# Altium schematic sheet Array.SchDoc
size C; Author: E. Sims; Organization: Let's Build Rockets Inc.; SheetNumber: 1; SheetTotal: 2
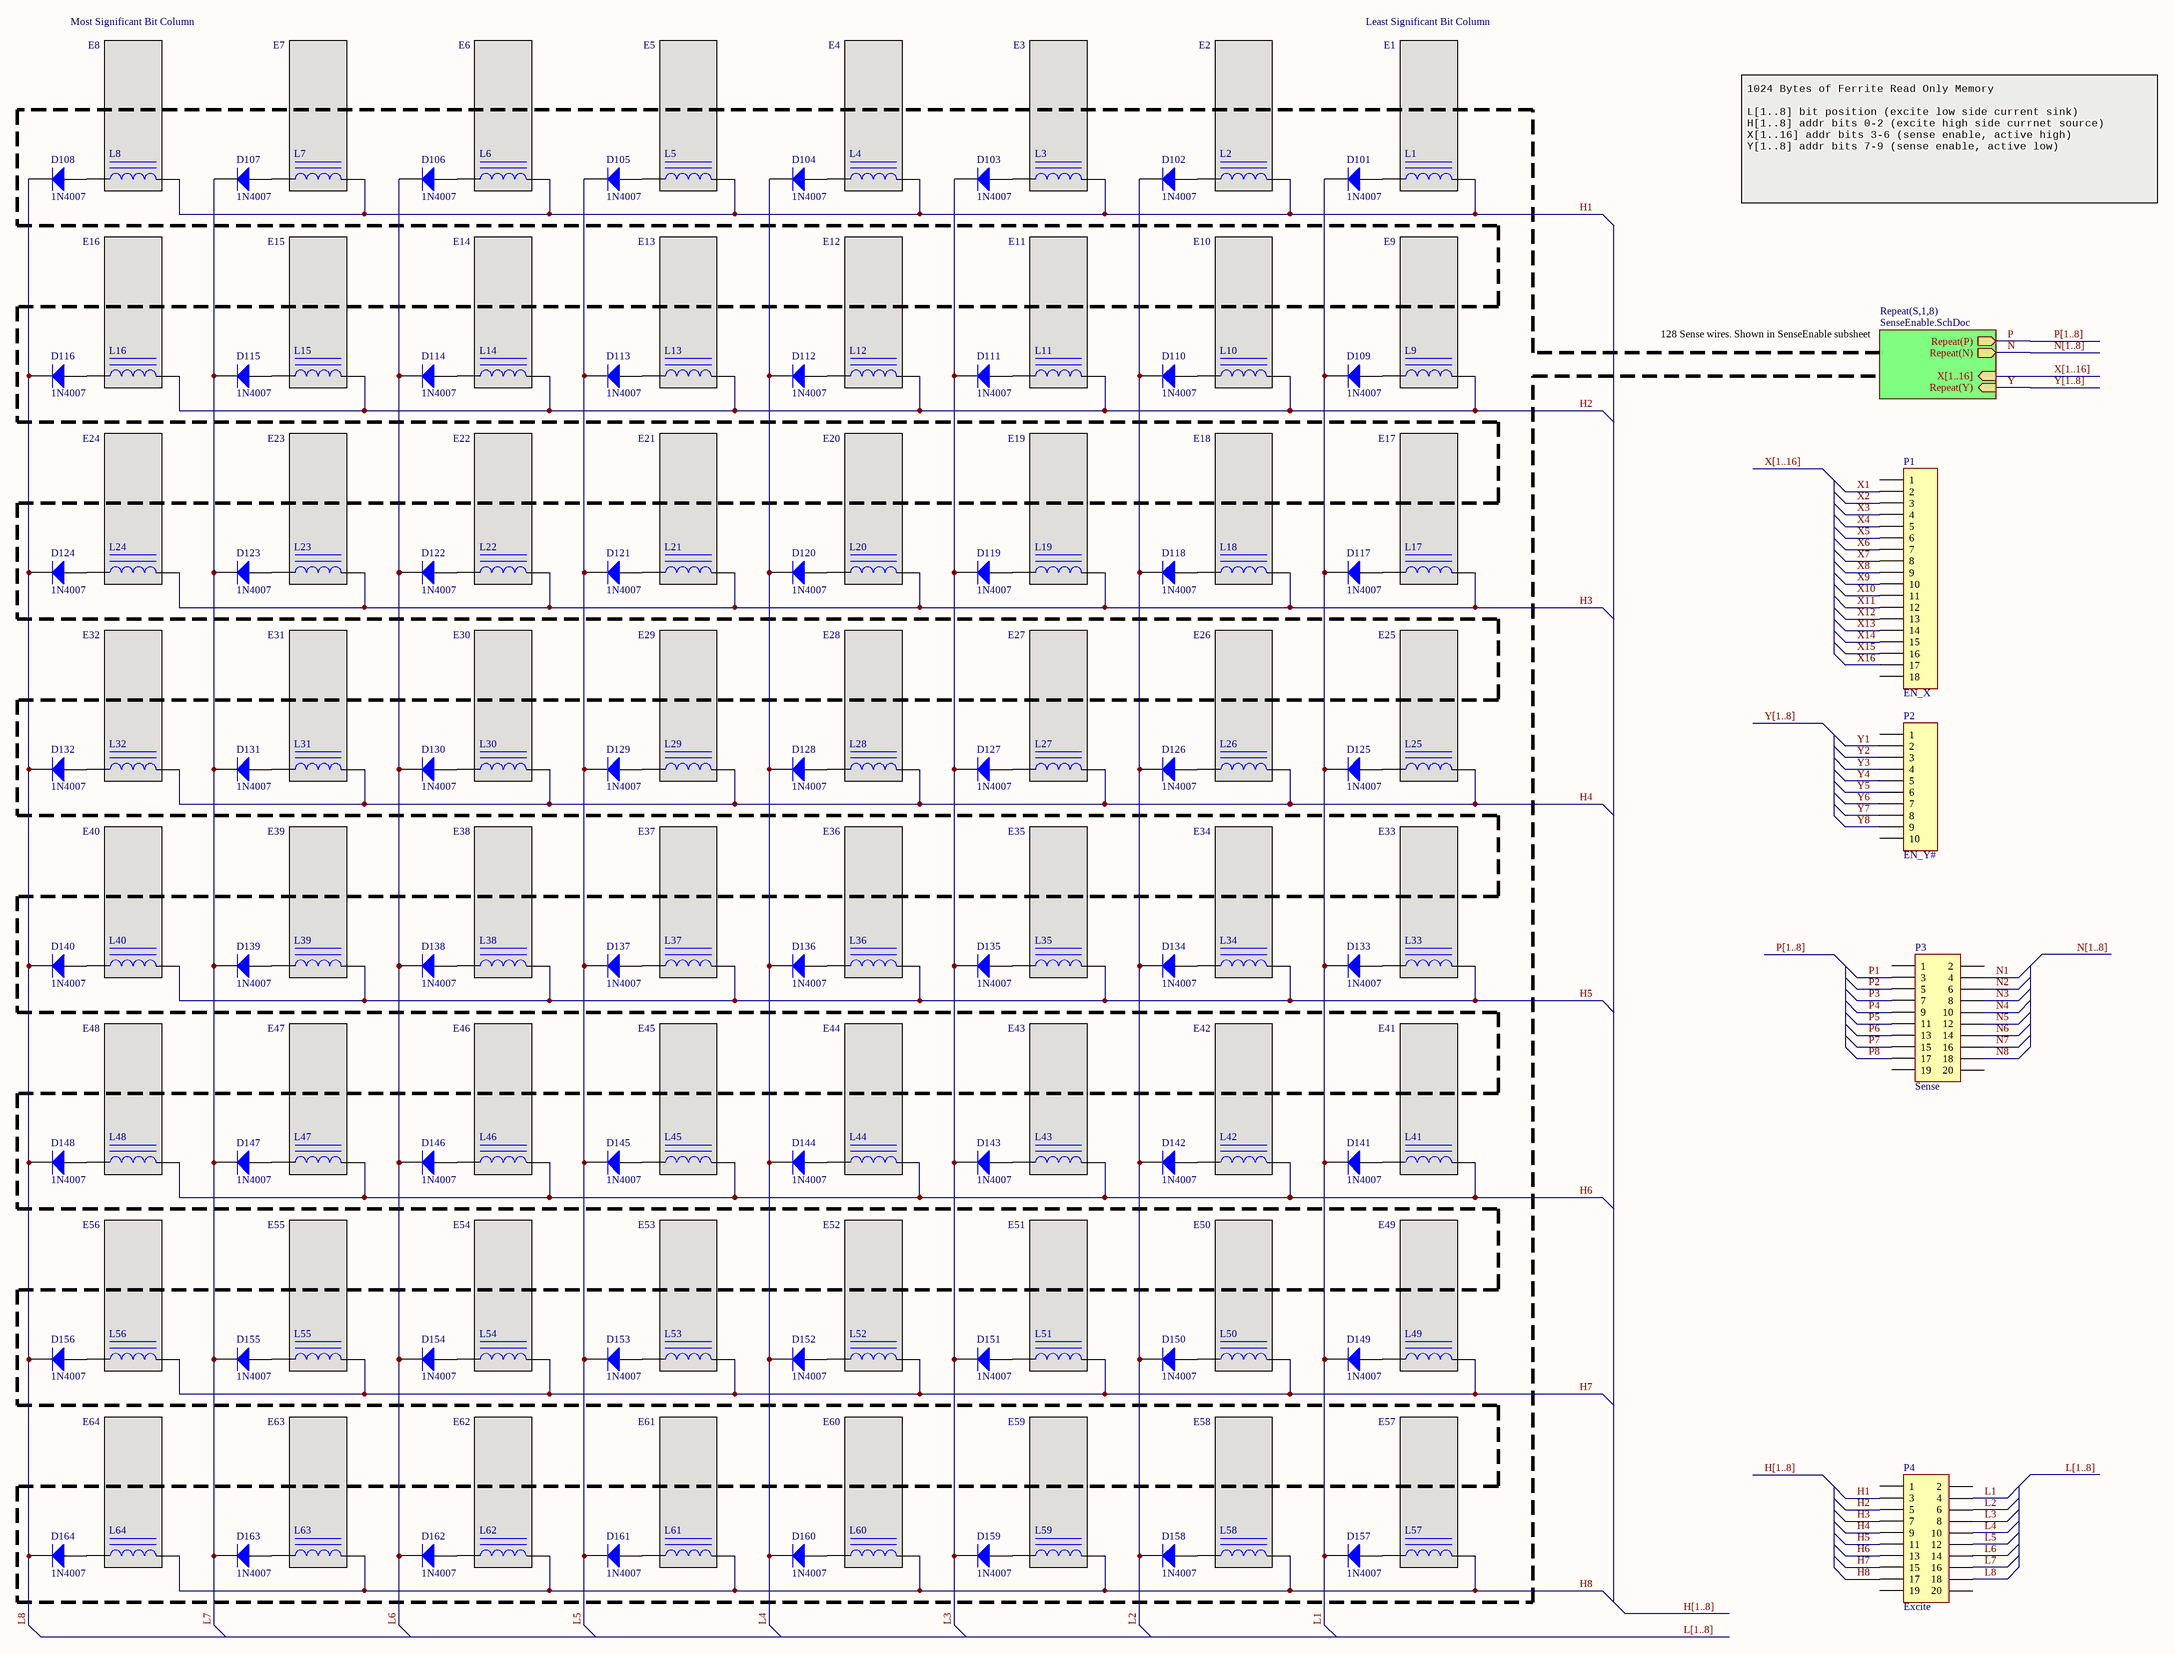
[diagram p0: Array.SchDoc]

## Parts
D101  1N4007  [DO-41]
D102  1N4007  [DO-41]
D103  1N4007  [DO-41]
D104  1N4007  [DO-41]
D105  1N4007  [DO-41]
D106  1N4007  [DO-41]
D107  1N4007  [DO-41]
D108  1N4007  [DO-41]
D109  1N4007  [DO-41]
D110  1N4007  [DO-41]
D111  1N4007  [DO-41]
D112  1N4007  [DO-41]
D113  1N4007  [DO-41]
D114  1N4007  [DO-41]
D115  1N4007  [DO-41]
D116  1N4007  [DO-41]
D117  1N4007  [DO-41]
D118  1N4007  [DO-41]
D119  1N4007  [DO-41]
D120  1N4007  [DO-41]
D121  1N4007  [DO-41]
D122  1N4007  [DO-41]
D123  1N4007  [DO-41]
D124  1N4007  [DO-41]
D125  1N4007  [DO-41]
D126  1N4007  [DO-41]
D127  1N4007  [DO-41]
D128  1N4007  [DO-41]
D129  1N4007  [DO-41]
D130  1N4007  [DO-41]
D131  1N4007  [DO-41]
D132  1N4007  [DO-41]
D133  1N4007  [DO-41]
D134  1N4007  [DO-41]
D135  1N4007  [DO-41]
D136  1N4007  [DO-41]
D137  1N4007  [DO-41]
D138  1N4007  [DO-41]
D139  1N4007  [DO-41]
D140  1N4007  [DO-41]
D141  1N4007  [DO-41]
D142  1N4007  [DO-41]
D143  1N4007  [DO-41]
D144  1N4007  [DO-41]
D145  1N4007  [DO-41]
D146  1N4007  [DO-41]
D147  1N4007  [DO-41]
D148  1N4007  [DO-41]
D149  1N4007  [DO-41]
D150  1N4007  [DO-41]
D151  1N4007  [DO-41]
D152  1N4007  [DO-41]
D153  1N4007  [DO-41]
D154  1N4007  [DO-41]
D155  1N4007  [DO-41]
D156  1N4007  [DO-41]
D157  1N4007  [DO-41]
D158  1N4007  [DO-41]
D159  1N4007  [DO-41]
D160  1N4007  [DO-41]
D161  1N4007  [DO-41]
D162  1N4007  [DO-41]
D163  1N4007  [DO-41]
D164  1N4007  [DO-41]
L1  Inductor Iron  [AXIAL-0.9]  (value not drawn)
L2  Inductor Iron  [AXIAL-0.9]  (value not drawn)
L3  Inductor Iron  [AXIAL-0.9]  (value not drawn)
L4  Inductor Iron  [AXIAL-0.9]  (value not drawn)
L5  Inductor Iron  [AXIAL-0.9]  (value not drawn)
L6  Inductor Iron  [AXIAL-0.9]  (value not drawn)
L7  Inductor Iron  [AXIAL-0.9]  (value not drawn)
L8  Inductor Iron  [AXIAL-0.9]  (value not drawn)
L9  Inductor Iron  [AXIAL-0.9]  (value not drawn)
L10  Inductor Iron  [AXIAL-0.9]  (value not drawn)
L11  Inductor Iron  [AXIAL-0.9]  (value not drawn)
L12  Inductor Iron  [AXIAL-0.9]  (value not drawn)
L13  Inductor Iron  [AXIAL-0.9]  (value not drawn)
L14  Inductor Iron  [AXIAL-0.9]  (value not drawn)
L15  Inductor Iron  [AXIAL-0.9]  (value not drawn)
L16  Inductor Iron  [AXIAL-0.9]  (value not drawn)
L17  Inductor Iron  [AXIAL-0.9]  (value not drawn)
L18  Inductor Iron  [AXIAL-0.9]  (value not drawn)
L19  Inductor Iron  [AXIAL-0.9]  (value not drawn)
L20  Inductor Iron  [AXIAL-0.9]  (value not drawn)
L21  Inductor Iron  [AXIAL-0.9]  (value not drawn)
L22  Inductor Iron  [AXIAL-0.9]  (value not drawn)
L23  Inductor Iron  [AXIAL-0.9]  (value not drawn)
L24  Inductor Iron  [AXIAL-0.9]  (value not drawn)
L25  Inductor Iron  [AXIAL-0.9]  (value not drawn)
L26  Inductor Iron  [AXIAL-0.9]  (value not drawn)
L27  Inductor Iron  [AXIAL-0.9]  (value not drawn)
L28  Inductor Iron  [AXIAL-0.9]  (value not drawn)
L29  Inductor Iron  [AXIAL-0.9]  (value not drawn)
L30  Inductor Iron  [AXIAL-0.9]  (value not drawn)
L31  Inductor Iron  [AXIAL-0.9]  (value not drawn)
L32  Inductor Iron  [AXIAL-0.9]  (value not drawn)
L33  Inductor Iron  [AXIAL-0.9]  (value not drawn)
L34  Inductor Iron  [AXIAL-0.9]  (value not drawn)
L35  Inductor Iron  [AXIAL-0.9]  (value not drawn)
L36  Inductor Iron  [AXIAL-0.9]  (value not drawn)
L37  Inductor Iron  [AXIAL-0.9]  (value not drawn)
L38  Inductor Iron  [AXIAL-0.9]  (value not drawn)
L39  Inductor Iron  [AXIAL-0.9]  (value not drawn)
L40  Inductor Iron  [AXIAL-0.9]  (value not drawn)
L41  Inductor Iron  [AXIAL-0.9]  (value not drawn)
L42  Inductor Iron  [AXIAL-0.9]  (value not drawn)
L43  Inductor Iron  [AXIAL-0.9]  (value not drawn)
L44  Inductor Iron  [AXIAL-0.9]  (value not drawn)
L45  Inductor Iron  [AXIAL-0.9]  (value not drawn)
L46  Inductor Iron  [AXIAL-0.9]  (value not drawn)
L47  Inductor Iron  [AXIAL-0.9]  (value not drawn)
L48  Inductor Iron  [AXIAL-0.9]  (value not drawn)
L49  Inductor Iron  [AXIAL-0.9]  (value not drawn)
L50  Inductor Iron  [AXIAL-0.9]  (value not drawn)
L51  Inductor Iron  [AXIAL-0.9]  (value not drawn)
L52  Inductor Iron  [AXIAL-0.9]  (value not drawn)
L53  Inductor Iron  [AXIAL-0.9]  (value not drawn)
L54  Inductor Iron  [AXIAL-0.9]  (value not drawn)
L55  Inductor Iron  [AXIAL-0.9]  (value not drawn)
L56  Inductor Iron  [AXIAL-0.9]  (value not drawn)
L57  Inductor Iron  [AXIAL-0.9]  (value not drawn)
L58  Inductor Iron  [AXIAL-0.9]  (value not drawn)
L59  Inductor Iron  [AXIAL-0.9]  (value not drawn)
L60  Inductor Iron  [AXIAL-0.9]  (value not drawn)
L61  Inductor Iron  [AXIAL-0.9]  (value not drawn)
L62  Inductor Iron  [AXIAL-0.9]  (value not drawn)
L63  Inductor Iron  [AXIAL-0.9]  (value not drawn)
L64  Inductor Iron  [AXIAL-0.9]  (value not drawn)
P1  EN_X  [HDR1X18]
P2  EN_Y#  [HDR1X10]
P3  Sense  [HDR2X10]
P4  Excite  [HDR2X10]

## Blocks framed on the sheet
Most Significant Bit Column: L8
Least Significant Bit Column: L1

## Sub-sheets
Repeat(S,1,8) = SenseEnable.SchDoc: Repeat(P) (out), Repeat(N) (out), Repeat(Y) (in), X[1..16] (in)

## Nets
H1: L1.2 L2.2 L3.2 L4.2 L5.2 L6.2 L7.2 L8.2 P4.3
H2: L9.2 L10.2 L11.2 L12.2 L13.2 L14.2 L15.2 L16.2 P4.5
H3: L17.2 L18.2 L19.2 L20.2 L21.2 L22.2 L23.2 L24.2 P4.7
H4: L25.2 L26.2 L27.2 L28.2 L29.2 L30.2 L31.2 L32.2 P4.9
H5: L33.2 L34.2 L35.2 L36.2 L37.2 L38.2 L39.2 L40.2 P4.11
H6: L41.2 L42.2 L43.2 L44.2 L45.2 L46.2 L47.2 L48.2 P4.13
H7: L49.2 L50.2 L51.2 L52.2 L53.2 L54.2 L55.2 L56.2 P4.15
H8: L57.2 L58.2 L59.2 L60.2 L61.2 L62.2 L63.2 L64.2 P4.17
L1: D101.2(K) D109.2(K) D117.2(K) D125.2(K) D133.2(K) D141.2(K) D149.2(K) D157.2(K) P4.4
L2: D102.2(K) D110.2(K) D118.2(K) D126.2(K) D134.2(K) D142.2(K) D150.2(K) D158.2(K) P4.6
L3: D103.2(K) D111.2(K) D119.2(K) D127.2(K) D135.2(K) D143.2(K) D151.2(K) D159.2(K) P4.8
L4: D104.2(K) D112.2(K) D120.2(K) D128.2(K) D136.2(K) D144.2(K) D152.2(K) D160.2(K) P4.10
L5: D105.2(K) D113.2(K) D121.2(K) D129.2(K) D137.2(K) D145.2(K) D153.2(K) D161.2(K) P4.12
L6: D106.2(K) D114.2(K) D122.2(K) D130.2(K) D138.2(K) D146.2(K) D154.2(K) D162.2(K) P4.14
L7: D107.2(K) D115.2(K) D123.2(K) D131.2(K) D139.2(K) D147.2(K) D155.2(K) D163.2(K) P4.16
L8: D108.2(K) D116.2(K) D124.2(K) D132.2(K) D140.2(K) D148.2(K) D156.2(K) D164.2(K) P4.18
N: sheet Repeat(S,1,8)/Repeat(N)
N1: P3.4
N2: P3.6
N3: P3.8
N4: P3.10
N5: P3.12
N6: P3.14
N7: P3.16
N8: P3.18
P: sheet Repeat(S,1,8)/Repeat(P)
P1: P3.3
P2: P3.5
P3: P3.7
P4: P3.9
P5: P3.11
P6: P3.13
P7: P3.15
P8: P3.17
X1: P1.2
X2: P1.3
X3: P1.4
X4: P1.5
X5: P1.6
X6: P1.7
X7: P1.8
X8: P1.9
X9: P1.10
X10: P1.11
X11: P1.12
X12: P1.13
X13: P1.14
X14: P1.15
X15: P1.16
X16: P1.17
Y: sheet Repeat(S,1,8)/Repeat(Y)
Y1: P2.2
Y2: P2.3
Y3: P2.4
Y4: P2.5
Y5: P2.6
Y6: P2.7
Y7: P2.8
Y8: P2.9
NetD101_1: D101.1(A) L1.1
NetD102_1: D102.1(A) L2.1
NetD103_1: D103.1(A) L3.1
NetD104_1: D104.1(A) L4.1
NetD105_1: D105.1(A) L5.1
NetD106_1: D106.1(A) L6.1
NetD107_1: D107.1(A) L7.1
NetD108_1: D108.1(A) L8.1
NetD109_1: D109.1(A) L9.1
NetD110_1: D110.1(A) L10.1
NetD111_1: D111.1(A) L11.1
NetD112_1: D112.1(A) L12.1
NetD113_1: D113.1(A) L13.1
NetD114_1: D114.1(A) L14.1
NetD115_1: D115.1(A) L15.1
NetD116_1: D116.1(A) L16.1
NetD117_1: D117.1(A) L17.1
NetD118_1: D118.1(A) L18.1
NetD119_1: D119.1(A) L19.1
NetD120_1: D120.1(A) L20.1
NetD121_1: D121.1(A) L21.1
NetD122_1: D122.1(A) L22.1
NetD123_1: D123.1(A) L23.1
NetD124_1: D124.1(A) L24.1
NetD125_1: D125.1(A) L25.1
NetD126_1: D126.1(A) L26.1
NetD127_1: D127.1(A) L27.1
NetD128_1: D128.1(A) L28.1
NetD129_1: D129.1(A) L29.1
NetD130_1: D130.1(A) L30.1
NetD131_1: D131.1(A) L31.1
NetD132_1: D132.1(A) L32.1
NetD133_1: D133.1(A) L33.1
NetD134_1: D134.1(A) L34.1
NetD135_1: D135.1(A) L35.1
NetD136_1: D136.1(A) L36.1
NetD137_1: D137.1(A) L37.1
NetD138_1: D138.1(A) L38.1
NetD139_1: D139.1(A) L39.1
NetD140_1: D140.1(A) L40.1
NetD141_1: D141.1(A) L41.1
NetD142_1: D142.1(A) L42.1
NetD143_1: D143.1(A) L43.1
NetD144_1: D144.1(A) L44.1
NetD145_1: D145.1(A) L45.1
NetD146_1: D146.1(A) L46.1
NetD147_1: D147.1(A) L47.1
NetD148_1: D148.1(A) L48.1
NetD149_1: D149.1(A) L49.1
NetD150_1: D150.1(A) L50.1
NetD151_1: D151.1(A) L51.1
NetD152_1: D152.1(A) L52.1
NetD153_1: D153.1(A) L53.1
NetD154_1: D154.1(A) L54.1
NetD155_1: D155.1(A) L55.1
NetD156_1: D156.1(A) L56.1
NetD157_1: D157.1(A) L57.1
NetD158_1: D158.1(A) L58.1
NetD159_1: D159.1(A) L59.1
NetD160_1: D160.1(A) L60.1
NetD161_1: D161.1(A) L61.1
NetD162_1: D162.1(A) L62.1
NetD163_1: D163.1(A) L63.1
NetD164_1: D164.1(A) L64.1

Not connected (* = marked no-connect by the designer): P1 1 18; P2 1 10; P3 1 2 19 20; P4 1 2 19 20

## Buses and harness runs
bus H[1..8]
bus L[1..8]
bus N[1..8]
bus P[1..8]
bus X[1..16]
bus X[1..16] = sheet Repeat(S,1,8)/X[1..16]
bus Y[1..8]

## Notes on the sheet
- E8
- E7
- E6
- E5
- E4
- E3
- E2
- E1
- 1024 Bytes of Ferrite Read Only Memory
  L[1..8] bit position (excite low side current sink)
  H[1..8] addr bits 0-2 (excite high side currnet source)
  X[1..16] addr bits 3-6 (sense enable, active high)
  Y[1..8] addr bits 7-9 (sense enable, active low)
- E16
- E15
- E14
- E13
- E12
- E11
- E10
- E9
- 128 Sense wires. Shown in SenseEnable subsheet
- E24
- E23
- E22
- E21
- E20
- E19
- E18
- E17
- E32
- E31
- E30
- E29
- E28
- E27
- E26
- E25
- E40
- E39
- E38
- E37
- E36
- E35
- E34
- E33
- E48
- E47
- E46
- E45
- E44
- E43
- E42
- E41
- E56
- E55
- E54
- E53
- E52
- E51
- E50
- E49
- E64
- E63
- E62
- E61
- E60
- E59
- E58
- E57
- Let's Build Rocket's Inc. Modular Paylaod System Based on TMP-010 Rev
  For more information visit https://github.com/LetsBuildRockets/Modular-Payload-System
  This work is licensed under CC BY-NC 4.0. To view a copy of this license, visit https://creativecommons.org/licenses/by-nc/4.0
- Title
- Size:
- Date:
- Assembly Variant:
- B
- Number:
- Time:
- Revision:
- Sheet
- of
- Author:
- File:

## Library data of the parts
D101-D164 = Diode 1N4007: 1 Amp General Purpose Rectifier; Published: 8-Jun-2000; LatestRevisionDate: 17-Jul-2002; LatestRevisionNote: Re-released for DXP Platform.; DatasheetVersion: 1998; PackageVersion: Aug-1999; PackageReference: DO-41; Publisher: Altium Limited; PackageDescription: Diode, Axial; Body 5.2 x 2.7 mm (LxDia. max), Lead Dia. 0.86 mm (max); Code_JEDEC: DO-204-AL; ComponentLink1Description: Manufacturer Link; ComponentLink1URL: http://www.fairchildsemi.com/; ComponentLink2Description: Datasheet; ComponentLink2URL: http://www.fairchildsemi.com/ds/1N%2F1N4001.pdf
L1-L64 = Inductor Iron: Magnetic-Core Inductor; Value: 10mH; Published: 24-Mar-1999; LatestRevisionDate: 17-Jul-2002; LatestRevisionNote: Re-released for DXP Platform.; PackageReference: AXIAL-0.9; Publisher: Altium Limited; PackageDescription: Axial Device, Thru-Hole; 2 Leads; 0.9 in Pin Spacing
P1 = Header 18: Header, 18-Pin; LatestRevisionDate: 17-Jul-2002; LatestRevisionNote: Re-released for DXP Platform.; Publisher: Altium Limited
P2 = Header 10: Header, 10-Pin; LatestRevisionDate: 17-Jul-2002; LatestRevisionNote: Re-released for DXP Platform.; Publisher: Altium Limited
P3 P4 = Header 10X2: Header, 10-Pin, Dual row; LatestRevisionDate: 17-Jul-2002; LatestRevisionNote: Re-released for DXP Platform.; Publisher: Altium Limited